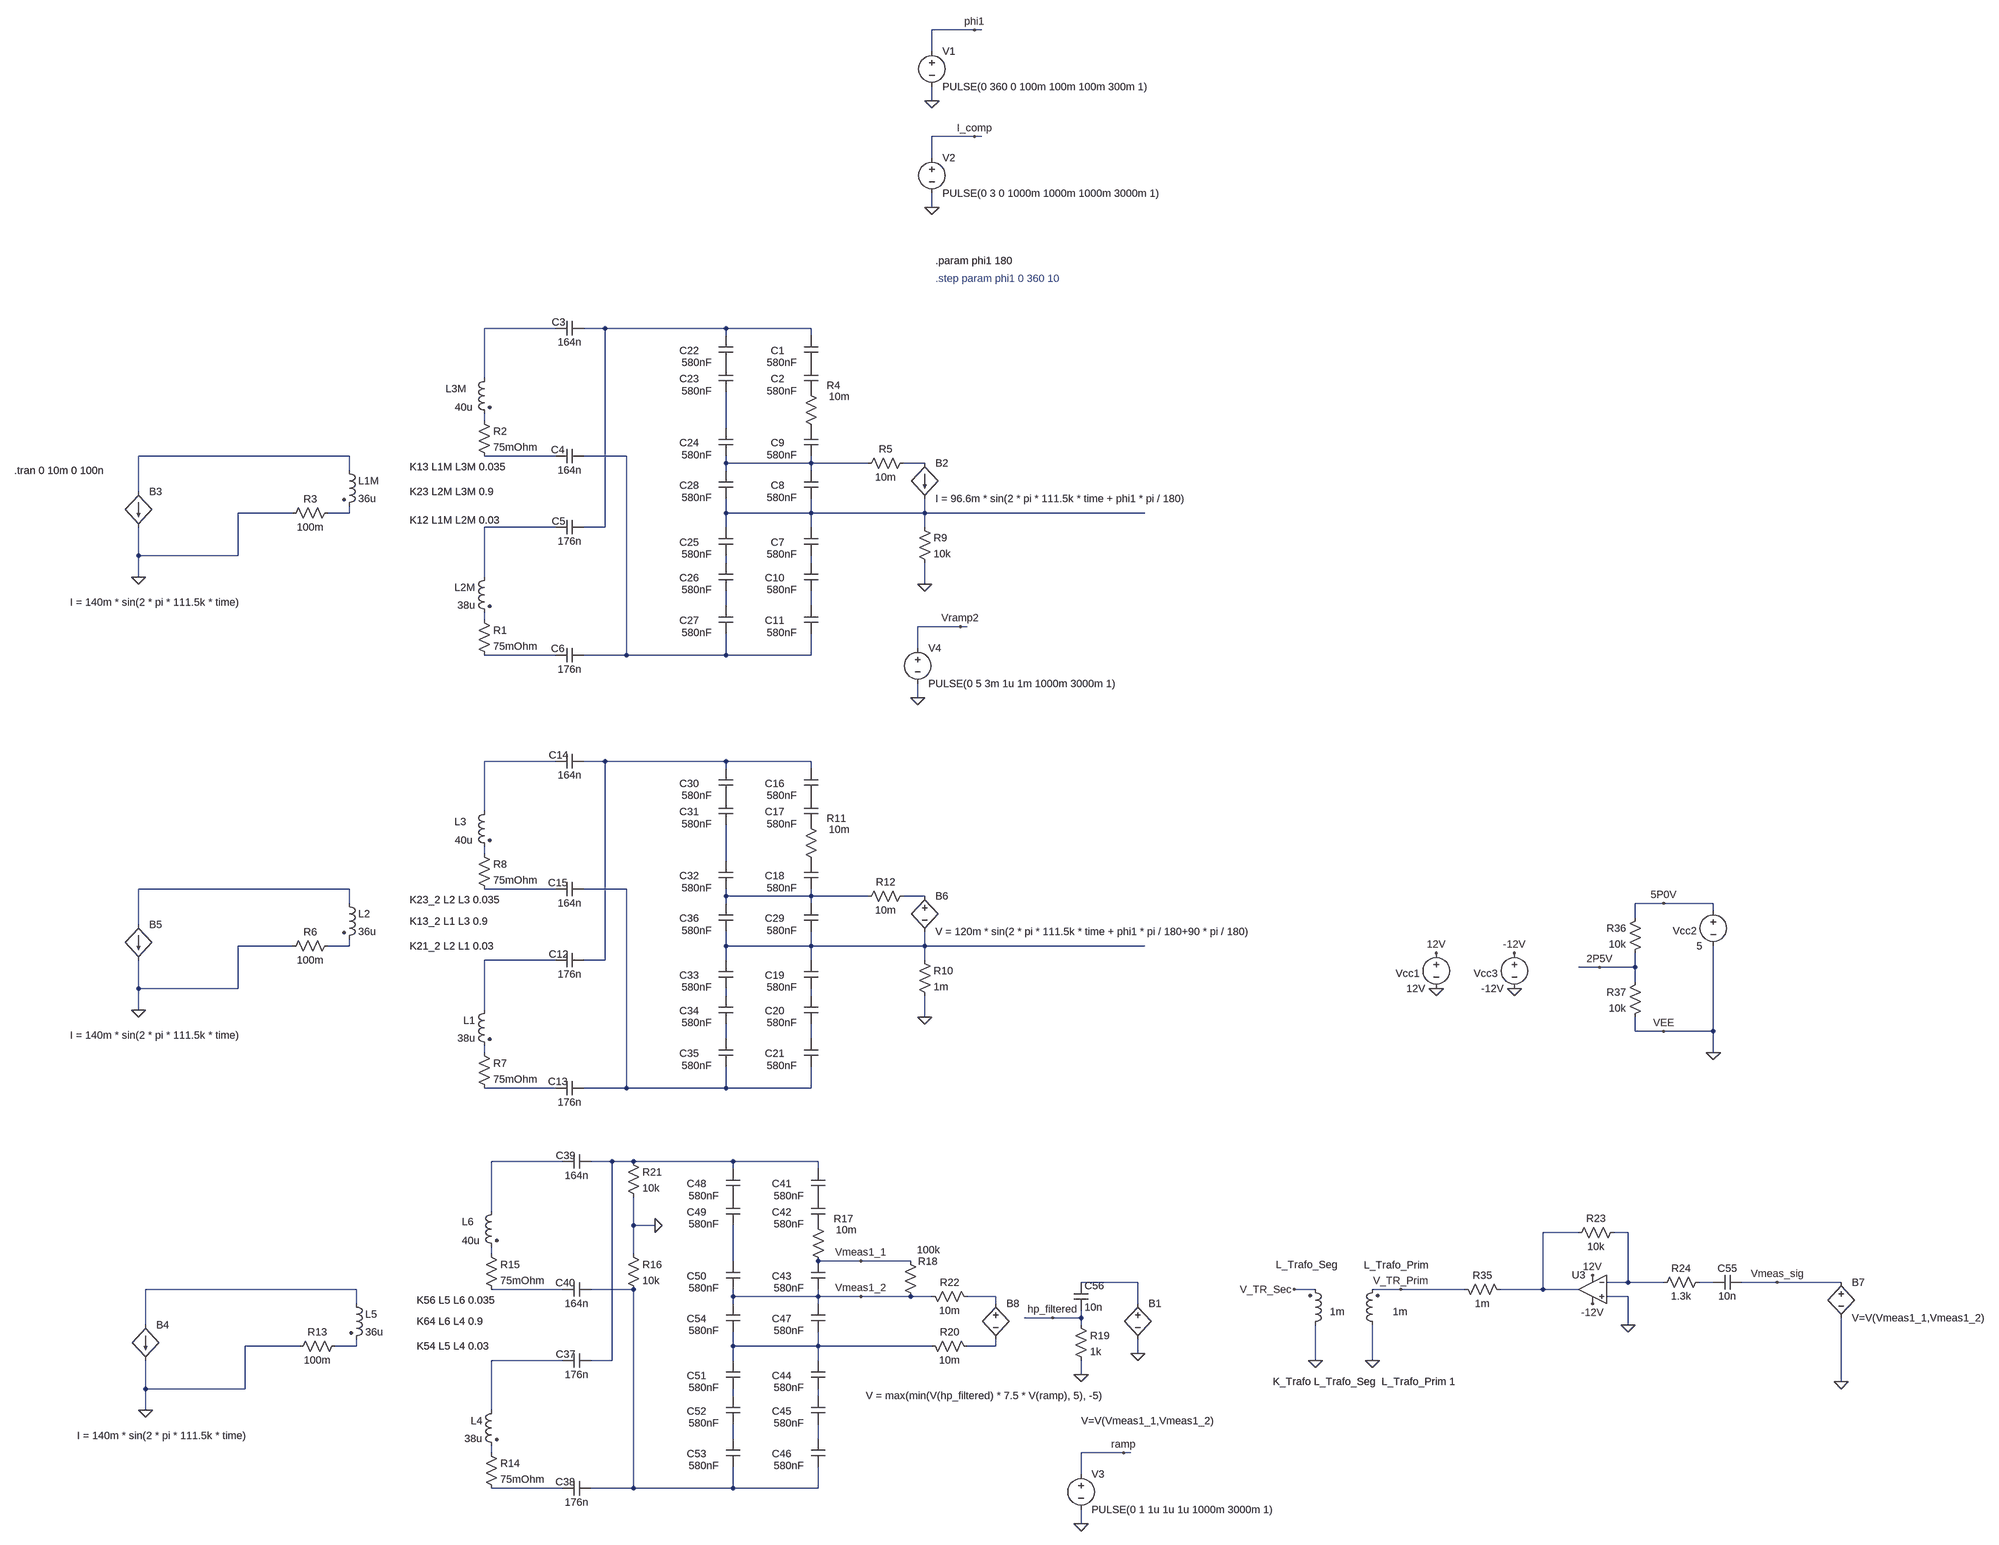
[diagram p0: schematic IMN_DIPS_CANCELATION_2.asc]
IMN_DIPS_CANCELATION_2.asc, the LTspice schematic file:
Version 4
SHEET 1 9932 3220
WIRE 3360 -1808 3264 -1808
WIRE 3376 -1808 3360 -1808
WIRE 3264 -1760 3264 -1808
WIRE 3264 -1648 3264 -1680
WIRE 3360 -1568 3264 -1568
WIRE 3376 -1568 3360 -1568
WIRE 3264 -1520 3264 -1568
WIRE 3264 -1408 3264 -1440
WIRE 2416 -1136 2256 -1136
WIRE 2528 -1136 2480 -1136
WIRE 2800 -1136 2528 -1136
WIRE 2992 -1136 2800 -1136
WIRE 2800 -1120 2800 -1136
WIRE 2992 -1120 2992 -1136
WIRE 2256 -1024 2256 -1136
WIRE 2256 -928 2256 -944
WIRE 2800 -912 2800 -992
WIRE 1952 -848 1472 -848
WIRE 2416 -848 2256 -848
WIRE 2576 -848 2480 -848
WIRE 2800 -832 2800 -848
WIRE 2992 -832 2992 -848
WIRE 2992 -832 2800 -832
WIRE 3120 -832 2992 -832
WIRE 3248 -832 3200 -832
WIRE 1952 -816 1952 -848
WIRE 2800 -816 2800 -832
WIRE 2992 -816 2992 -832
WIRE 1472 -768 1472 -848
WIRE 1824 -720 1696 -720
WIRE 1952 -720 1952 -736
WIRE 1952 -720 1904 -720
WIRE 2800 -720 2800 -752
WIRE 2992 -720 2992 -752
WIRE 2992 -720 2800 -720
WIRE 3248 -720 3248 -752
WIRE 3248 -720 2992 -720
WIRE 3744 -720 3248 -720
WIRE 2416 -688 2256 -688
WIRE 2528 -688 2528 -1136
WIRE 2528 -688 2480 -688
WIRE 2800 -688 2800 -720
WIRE 2992 -688 2992 -720
WIRE 3248 -688 3248 -720
WIRE 1472 -624 1472 -688
WIRE 1696 -624 1696 -720
WIRE 1696 -624 1472 -624
WIRE 2800 -608 2800 -624
WIRE 2992 -608 2992 -624
WIRE 1472 -576 1472 -624
WIRE 2256 -576 2256 -688
WIRE 3248 -560 3248 -608
WIRE 2800 -512 2800 -544
WIRE 2992 -512 2992 -544
WIRE 2256 -480 2256 -496
WIRE 3328 -464 3232 -464
WIRE 3344 -464 3328 -464
WIRE 3232 -416 3232 -464
WIRE 2416 -400 2256 -400
WIRE 2576 -400 2576 -848
WIRE 2576 -400 2480 -400
WIRE 2800 -400 2800 -448
WIRE 2800 -400 2576 -400
WIRE 2992 -400 2992 -448
WIRE 2992 -400 2800 -400
WIRE 3232 -304 3232 -336
WIRE 2416 -16 2256 -16
WIRE 2528 -16 2480 -16
WIRE 2800 -16 2528 -16
WIRE 2992 -16 2800 -16
WIRE 2800 0 2800 -16
WIRE 2992 0 2992 -16
WIRE 2256 96 2256 -16
WIRE 2256 192 2256 176
WIRE 2800 208 2800 128
WIRE 1952 272 1472 272
WIRE 2416 272 2256 272
WIRE 2576 272 2480 272
WIRE 2800 288 2800 272
WIRE 2992 288 2992 272
WIRE 2992 288 2800 288
WIRE 3120 288 2992 288
WIRE 3248 288 3200 288
WIRE 1952 304 1952 272
WIRE 2800 304 2800 288
WIRE 2992 304 2992 288
WIRE 4912 304 4848 304
WIRE 5024 304 4912 304
WIRE 5024 320 5024 304
WIRE 4848 336 4848 304
WIRE 1472 352 1472 272
WIRE 1824 400 1696 400
WIRE 1952 400 1952 384
WIRE 1952 400 1904 400
WIRE 2800 400 2800 368
WIRE 2992 400 2992 368
WIRE 2992 400 2800 400
WIRE 3248 400 3248 368
WIRE 3248 400 2992 400
WIRE 3744 400 3248 400
WIRE 2416 432 2256 432
WIRE 2528 432 2528 -16
WIRE 2528 432 2480 432
WIRE 2800 432 2800 400
WIRE 2992 432 2992 400
WIRE 3248 432 3248 400
WIRE 4768 448 4720 448
WIRE 4848 448 4848 416
WIRE 4848 448 4768 448
WIRE 4848 480 4848 448
WIRE 1472 496 1472 432
WIRE 1696 496 1696 400
WIRE 1696 496 1472 496
WIRE 2800 512 2800 496
WIRE 2992 512 2992 496
WIRE 1472 544 1472 496
WIRE 2256 544 2256 432
WIRE 3248 560 3248 512
WIRE 4848 592 4848 560
WIRE 4912 592 4848 592
WIRE 5024 592 5024 400
WIRE 5024 592 4912 592
WIRE 2800 608 2800 576
WIRE 2992 608 2992 576
WIRE 2256 640 2256 624
WIRE 5024 640 5024 592
WIRE 2416 720 2256 720
WIRE 2576 720 2576 272
WIRE 2576 720 2480 720
WIRE 2800 720 2800 672
WIRE 2800 720 2576 720
WIRE 2992 720 2992 672
WIRE 2992 720 2800 720
WIRE 2432 912 2272 912
WIRE 2544 912 2496 912
WIRE 2592 912 2544 912
WIRE 2816 912 2592 912
WIRE 3008 912 2816 912
WIRE 2816 928 2816 912
WIRE 3008 928 3008 912
WIRE 2272 1024 2272 912
WIRE 2592 1056 2592 992
WIRE 2640 1056 2592 1056
WIRE 4720 1072 4640 1072
WIRE 4832 1072 4800 1072
WIRE 2272 1120 2272 1104
WIRE 2592 1120 2592 1056
WIRE 2816 1136 2816 1056
WIRE 3104 1136 3008 1136
WIRE 3216 1136 3104 1136
WIRE 3728 1184 3600 1184
WIRE 4832 1184 4832 1072
WIRE 4832 1184 4784 1184
WIRE 4912 1184 4832 1184
WIRE 5024 1184 4992 1184
WIRE 5168 1184 5088 1184
WIRE 5312 1184 5168 1184
WIRE 1968 1200 1488 1200
WIRE 2432 1200 2272 1200
WIRE 2592 1200 2496 1200
WIRE 4128 1200 4080 1200
WIRE 4320 1200 4256 1200
WIRE 4464 1200 4320 1200
WIRE 4640 1200 4640 1072
WIRE 4640 1200 4544 1200
WIRE 4720 1200 4640 1200
WIRE 2816 1216 2816 1200
WIRE 3008 1216 3008 1200
WIRE 3008 1216 2816 1216
WIRE 3104 1216 3008 1216
WIRE 3216 1216 3104 1216
WIRE 3264 1216 3216 1216
WIRE 3408 1216 3344 1216
WIRE 4832 1216 4784 1216
WIRE 1968 1232 1968 1200
WIRE 2816 1232 2816 1216
WIRE 3008 1232 3008 1216
WIRE 3408 1232 3408 1216
WIRE 3728 1232 3728 1184
WIRE 3536 1264 3472 1264
WIRE 3600 1264 3600 1248
WIRE 3600 1264 3536 1264
WIRE 1488 1280 1488 1200
WIRE 3600 1280 3600 1264
WIRE 4832 1280 4832 1216
WIRE 1840 1328 1712 1328
WIRE 1968 1328 1968 1312
WIRE 1968 1328 1920 1328
WIRE 2816 1328 2816 1296
WIRE 3008 1328 3008 1296
WIRE 3008 1328 2816 1328
WIRE 3264 1328 3008 1328
WIRE 3408 1328 3408 1312
WIRE 3408 1328 3344 1328
WIRE 3728 1344 3728 1312
WIRE 2432 1360 2272 1360
WIRE 2544 1360 2544 912
WIRE 2544 1360 2496 1360
WIRE 2816 1360 2816 1328
WIRE 3008 1360 3008 1328
WIRE 4128 1360 4128 1280
WIRE 4256 1360 4256 1280
WIRE 3600 1392 3600 1360
WIRE 5312 1408 5312 1264
WIRE 1488 1424 1488 1360
WIRE 1712 1424 1712 1328
WIRE 1712 1424 1488 1424
WIRE 2816 1440 2816 1424
WIRE 3008 1440 3008 1424
WIRE 1488 1472 1488 1424
WIRE 2272 1472 2272 1360
WIRE 2816 1536 2816 1504
WIRE 3008 1536 3008 1504
WIRE 2272 1568 2272 1552
WIRE 3696 1568 3600 1568
WIRE 3712 1568 3696 1568
WIRE 3600 1616 3600 1568
WIRE 2432 1648 2272 1648
WIRE 2592 1648 2592 1200
WIRE 2592 1648 2496 1648
WIRE 2816 1648 2816 1600
WIRE 2816 1648 2592 1648
WIRE 3008 1648 3008 1600
WIRE 3008 1648 2816 1648
WIRE 3600 1728 3600 1696
FLAG 1472 -576 0
FLAG 3248 -560 0
FLAG 3264 -1648 0
FLAG 3360 -1808 phi1
FLAG 3264 -1408 0
FLAG 3360 -1568 I_comp
FLAG 3600 1728 0
FLAG 3696 1568 ramp
FLAG 3232 -304 0
FLAG 3328 -464 Vramp2
FLAG 1472 544 0
FLAG 3248 560 0
FLAG 1488 1472 0
FLAG 3104 1136 Vmeas1_1
FLAG 4912 304 5P0V
FLAG 4912 592 VEE
FLAG 4768 448 2P5V
FLAG 5024 640 0
FLAG 4128 1360 0
FLAG 4832 1280 0
FLAG 4256 1360 0
FLAG 4400 496 0
FLAG 4576 496 0
FLAG 4400 416 12V
FLAG 4576 416 -12V
FLAG 4752 1168 12V
FLAG 4752 1232 -12V
FLAG 4320 1200 V_TR_Prim
FLAG 4080 1200 V_TR_Sec
FLAG 5312 1408 0
FLAG 5168 1184 Vmeas_sig
FLAG 3104 1216 Vmeas1_2
FLAG 3728 1344 0
FLAG 3600 1392 0
FLAG 3536 1264 hp_filtered
FLAG 2640 1056 0
SYMBOL ind2 2272 -592 M0
SYMATTR Value 38u
SYMATTR InstName L2M
SYMATTR Type ind
SYMATTR SpiceLine Rpar=1MEG
SYMBOL ind2 1936 -832 R0
SYMATTR InstName L1M
SYMATTR Value 36u
SYMATTR Type ind
SYMATTR SpiceLine Rpar=1MEG
SYMBOL cap 2416 -672 R270
WINDOW 0 14 7 VTop 2
WINDOW 3 0 32 VBottom 2
SYMATTR InstName C5
SYMATTR Value 176n
SYMATTR SpiceLine Rser=3m
SYMBOL res 1920 -736 R90
WINDOW 0 0 56 VBottom 2
WINDOW 3 32 56 VTop 2
SYMATTR InstName R3
SYMATTR Value 100m
SYMBOL cap 2416 -384 R270
WINDOW 0 15 6 VTop 2
WINDOW 3 0 32 VBottom 2
SYMATTR InstName C6
SYMATTR Value 176n
SYMATTR SpiceLine Rser=3m
SYMBOL ind2 2272 -1040 M0
WINDOW 3 42 82 Left 2
WINDOW 0 56 40 Left 2
SYMATTR Value 40u
SYMATTR InstName L3M
SYMATTR Type ind
SYMATTR SpiceLine Rpar=1MEG
SYMBOL cap 2416 -1120 R270
WINDOW 0 14 7 VTop 2
WINDOW 3 0 32 VBottom 2
SYMATTR InstName C3
SYMATTR Value 164n
SYMATTR SpiceLine Rser=3m
SYMBOL cap 2416 -832 R270
WINDOW 0 15 6 VTop 2
WINDOW 3 0 32 VBottom 2
SYMATTR InstName C4
SYMATTR Value 164n
SYMATTR SpiceLine Rser=3m
SYMBOL res 2240 -496 R0
SYMATTR InstName R1
SYMATTR Value 75mOhm
SYMBOL res 2240 -944 R0
SYMATTR InstName R2
SYMATTR Value 75mOhm
SYMBOL cap 3008 -1056 R180
WINDOW 0 76 30 Left 2
WINDOW 3 47 3 Left 2
SYMATTR InstName C1
SYMATTR Value 580nF
SYMATTR SpiceLine Rser=3m
SYMBOL cap 3008 -992 R180
WINDOW 0 76 30 Left 2
WINDOW 3 47 3 Left 2
SYMATTR InstName C2
SYMATTR Value 580nF
SYMATTR SpiceLine Rser=3m
SYMBOL cap 3008 -848 R180
WINDOW 0 76 30 Left 2
WINDOW 3 47 3 Left 2
SYMATTR InstName C9
SYMATTR Value 580nF
SYMATTR SpiceLine Rser=3m
SYMBOL cap 3008 -624 R180
WINDOW 0 76 30 Left 2
WINDOW 3 47 3 Left 2
SYMATTR InstName C7
SYMATTR Value 580nF
SYMATTR SpiceLine Rser=3m
SYMBOL cap 3008 -544 R180
WINDOW 0 76 30 Left 2
WINDOW 3 47 3 Left 2
SYMATTR InstName C10
SYMATTR Value 580nF
SYMATTR SpiceLine Rser=3m
SYMBOL cap 3008 -448 R180
WINDOW 0 76 30 Left 2
WINDOW 3 47 3 Left 2
SYMATTR InstName C11
SYMATTR Value 580nF
SYMATTR SpiceLine Rser=3m
SYMBOL cap 3008 -752 R180
WINDOW 0 76 30 Left 2
WINDOW 3 47 3 Left 2
SYMATTR InstName C8
SYMATTR Value 580nF
SYMATTR SpiceLine Rser=3m
SYMBOL bi 3248 -832 R0
SYMATTR InstName B2
SYMATTR Value I = 96.6m * sin(2 * pi * 111.5k * time + phi1 * pi / 180)
SYMBOL res 3232 -704 R0
SYMATTR InstName R9
SYMATTR Value 10k
SYMBOL res 2976 -1008 R0
WINDOW 0 51 1 Left 2
WINDOW 3 56 26 Left 2
SYMATTR InstName R4
SYMATTR Value 10m
SYMBOL voltage 3264 -1776 R0
WINDOW 123 0 0 Left 0
WINDOW 39 0 0 Left 0
SYMATTR InstName V1
SYMATTR Value PULSE(0 360 0 100m 100m 100m 300m 1)
SYMBOL voltage 3264 -1536 R0
WINDOW 123 0 0 Left 0
WINDOW 39 0 0 Left 0
SYMATTR InstName V2
SYMATTR Value PULSE(0 3 0 1000m 1000m 1000m 3000m 1)
SYMBOL res 3216 -848 R90
WINDOW 0 0 56 VBottom 2
WINDOW 3 32 56 VTop 2
SYMATTR InstName R5
SYMATTR Value 10m
SYMBOL cap 2816 -1056 R180
WINDOW 0 76 30 Left 2
WINDOW 3 47 3 Left 2
SYMATTR InstName C22
SYMATTR Value 580nF
SYMATTR SpiceLine Rser=3m
SYMBOL cap 2816 -992 R180
WINDOW 0 76 30 Left 2
WINDOW 3 47 3 Left 2
SYMATTR InstName C23
SYMATTR Value 580nF
SYMATTR SpiceLine Rser=3m
SYMBOL cap 2816 -848 R180
WINDOW 0 76 30 Left 2
WINDOW 3 47 3 Left 2
SYMATTR InstName C24
SYMATTR Value 580nF
SYMATTR SpiceLine Rser=3m
SYMBOL cap 2816 -624 R180
WINDOW 0 76 30 Left 2
WINDOW 3 47 3 Left 2
SYMATTR InstName C25
SYMATTR Value 580nF
SYMATTR SpiceLine Rser=3m
SYMBOL cap 2816 -544 R180
WINDOW 0 76 30 Left 2
WINDOW 3 47 3 Left 2
SYMATTR InstName C26
SYMATTR Value 580nF
SYMATTR SpiceLine Rser=3m
SYMBOL cap 2816 -448 R180
WINDOW 0 76 30 Left 2
WINDOW 3 47 3 Left 2
SYMATTR InstName C27
SYMATTR Value 580nF
SYMATTR SpiceLine Rser=3m
SYMBOL cap 2816 -752 R180
WINDOW 0 76 30 Left 2
WINDOW 3 47 3 Left 2
SYMATTR InstName C28
SYMATTR Value 580nF
SYMATTR SpiceLine Rser=3m
SYMBOL bi 1472 -768 R0
WINDOW 3 -154 249 Left 2
SYMATTR Value I = 140m * sin(2 * pi * 111.5k * time)
SYMATTR InstName B3
SYMBOL voltage 3600 1600 R0
WINDOW 123 0 0 Left 0
WINDOW 39 0 0 Left 0
SYMATTR InstName V3
SYMATTR Value PULSE(0 1 1u 1u 1u 1000m 3000m 1)
SYMBOL voltage 3232 -432 R0
WINDOW 123 0 0 Left 0
WINDOW 39 0 0 Left 0
SYMATTR InstName V4
SYMATTR Value PULSE(0 5 3m 1u 1m 1000m 3000m 1)
SYMBOL ind2 2272 528 M0
SYMATTR Value 38u
SYMATTR InstName L1
SYMATTR Type ind
SYMATTR SpiceLine Rpar=1MEG
SYMBOL ind2 1936 288 R0
SYMATTR InstName L2
SYMATTR Value 36u
SYMATTR Type ind
SYMATTR SpiceLine Rpar=1MEG
SYMBOL cap 2416 448 R270
WINDOW 0 14 7 VTop 2
WINDOW 3 0 32 VBottom 2
SYMATTR InstName C12
SYMATTR Value 176n
SYMATTR SpiceLine Rser=3m
SYMBOL res 1920 384 R90
WINDOW 0 0 56 VBottom 2
WINDOW 3 32 56 VTop 2
SYMATTR InstName R6
SYMATTR Value 100m
SYMBOL cap 2416 736 R270
WINDOW 0 15 6 VTop 2
WINDOW 3 0 32 VBottom 2
SYMATTR InstName C13
SYMATTR Value 176n
SYMATTR SpiceLine Rser=3m
SYMBOL ind2 2272 80 M0
WINDOW 3 42 82 Left 2
WINDOW 0 56 40 Left 2
SYMATTR Value 40u
SYMATTR InstName L3
SYMATTR Type ind
SYMATTR SpiceLine Rpar=1MEG
SYMBOL cap 2416 0 R270
WINDOW 0 14 7 VTop 2
WINDOW 3 0 32 VBottom 2
SYMATTR InstName C14
SYMATTR Value 164n
SYMATTR SpiceLine Rser=3m
SYMBOL cap 2416 288 R270
WINDOW 0 15 6 VTop 2
WINDOW 3 0 32 VBottom 2
SYMATTR InstName C15
SYMATTR Value 164n
SYMATTR SpiceLine Rser=3m
SYMBOL res 2240 624 R0
SYMATTR InstName R7
SYMATTR Value 75mOhm
SYMBOL res 2240 176 R0
SYMATTR InstName R8
SYMATTR Value 75mOhm
SYMBOL cap 3008 64 R180
WINDOW 0 76 30 Left 2
WINDOW 3 47 3 Left 2
SYMATTR InstName C16
SYMATTR Value 580nF
SYMATTR SpiceLine Rser=3m
SYMBOL cap 3008 128 R180
WINDOW 0 76 30 Left 2
WINDOW 3 47 3 Left 2
SYMATTR InstName C17
SYMATTR Value 580nF
SYMATTR SpiceLine Rser=3m
SYMBOL cap 3008 272 R180
WINDOW 0 76 30 Left 2
WINDOW 3 47 3 Left 2
SYMATTR InstName C18
SYMATTR Value 580nF
SYMATTR SpiceLine Rser=3m
SYMBOL cap 3008 496 R180
WINDOW 0 76 30 Left 2
WINDOW 3 47 3 Left 2
SYMATTR InstName C19
SYMATTR Value 580nF
SYMATTR SpiceLine Rser=3m
SYMBOL cap 3008 576 R180
WINDOW 0 76 30 Left 2
WINDOW 3 47 3 Left 2
SYMATTR InstName C20
SYMATTR Value 580nF
SYMATTR SpiceLine Rser=3m
SYMBOL cap 3008 672 R180
WINDOW 0 76 30 Left 2
WINDOW 3 47 3 Left 2
SYMATTR InstName C21
SYMATTR Value 580nF
SYMATTR SpiceLine Rser=3m
SYMBOL cap 3008 368 R180
WINDOW 0 76 30 Left 2
WINDOW 3 47 3 Left 2
SYMATTR InstName C29
SYMATTR Value 580nF
SYMATTR SpiceLine Rser=3m
SYMBOL res 3232 416 R0
SYMATTR InstName R10
SYMATTR Value 1m
SYMBOL res 2976 112 R0
WINDOW 0 51 1 Left 2
WINDOW 3 56 26 Left 2
SYMATTR InstName R11
SYMATTR Value 10m
SYMBOL res 3216 272 R90
WINDOW 0 0 56 VBottom 2
WINDOW 3 32 56 VTop 2
SYMATTR InstName R12
SYMATTR Value 10m
SYMBOL cap 2816 64 R180
WINDOW 0 76 30 Left 2
WINDOW 3 47 3 Left 2
SYMATTR InstName C30
SYMATTR Value 580nF
SYMATTR SpiceLine Rser=3m
SYMBOL cap 2816 128 R180
WINDOW 0 76 30 Left 2
WINDOW 3 47 3 Left 2
SYMATTR InstName C31
SYMATTR Value 580nF
SYMATTR SpiceLine Rser=3m
SYMBOL cap 2816 272 R180
WINDOW 0 76 30 Left 2
WINDOW 3 47 3 Left 2
SYMATTR InstName C32
SYMATTR Value 580nF
SYMATTR SpiceLine Rser=3m
SYMBOL cap 2816 496 R180
WINDOW 0 76 30 Left 2
WINDOW 3 47 3 Left 2
SYMATTR InstName C33
SYMATTR Value 580nF
SYMATTR SpiceLine Rser=3m
SYMBOL cap 2816 576 R180
WINDOW 0 76 30 Left 2
WINDOW 3 47 3 Left 2
SYMATTR InstName C34
SYMATTR Value 580nF
SYMATTR SpiceLine Rser=3m
SYMBOL cap 2816 672 R180
WINDOW 0 76 30 Left 2
WINDOW 3 47 3 Left 2
SYMATTR InstName C35
SYMATTR Value 580nF
SYMATTR SpiceLine Rser=3m
SYMBOL cap 2816 368 R180
WINDOW 0 76 30 Left 2
WINDOW 3 47 3 Left 2
SYMATTR InstName C36
SYMATTR Value 580nF
SYMATTR SpiceLine Rser=3m
SYMBOL bi 1472 352 R0
WINDOW 3 -154 249 Left 2
SYMATTR Value I = 140m * sin(2 * pi * 111.5k * time)
SYMATTR InstName B5
SYMBOL bv 3248 272 R0
SYMATTR InstName B6
SYMATTR Value V = 120m * sin(2 * pi * 111.5k * time + phi1 * pi / 180+90 * pi / 180)
SYMBOL ind2 2288 1456 M0
SYMATTR Value 38u
SYMATTR InstName L4
SYMATTR Type ind
SYMATTR SpiceLine Rpar=1MEG
SYMBOL ind2 1952 1216 R0
SYMATTR InstName L5
SYMATTR Value 36u
SYMATTR Type ind
SYMATTR SpiceLine Rpar=1MEG
SYMBOL cap 2432 1376 R270
WINDOW 0 14 7 VTop 2
WINDOW 3 0 32 VBottom 2
SYMATTR InstName C37
SYMATTR Value 176n
SYMATTR SpiceLine Rser=3m
SYMBOL res 1936 1312 R90
WINDOW 0 0 56 VBottom 2
WINDOW 3 32 56 VTop 2
SYMATTR InstName R13
SYMATTR Value 100m
SYMBOL cap 2432 1664 R270
WINDOW 0 15 6 VTop 2
WINDOW 3 0 32 VBottom 2
SYMATTR InstName C38
SYMATTR Value 176n
SYMATTR SpiceLine Rser=3m
SYMBOL ind2 2288 1008 M0
WINDOW 3 42 82 Left 2
WINDOW 0 56 40 Left 2
SYMATTR Value 40u
SYMATTR InstName L6
SYMATTR Type ind
SYMATTR SpiceLine Rpar=1MEG
SYMBOL cap 2432 928 R270
WINDOW 0 14 7 VTop 2
WINDOW 3 0 32 VBottom 2
SYMATTR InstName C39
SYMATTR Value 164n
SYMATTR SpiceLine Rser=3m
SYMBOL cap 2432 1216 R270
WINDOW 0 15 6 VTop 2
WINDOW 3 0 32 VBottom 2
SYMATTR InstName C40
SYMATTR Value 164n
SYMATTR SpiceLine Rser=3m
SYMBOL res 2256 1552 R0
SYMATTR InstName R14
SYMATTR Value 75mOhm
SYMBOL res 2256 1104 R0
SYMATTR InstName R15
SYMATTR Value 75mOhm
SYMBOL cap 3024 992 R180
WINDOW 0 76 30 Left 2
WINDOW 3 47 3 Left 2
SYMATTR InstName C41
SYMATTR Value 580nF
SYMATTR SpiceLine Rser=3m
SYMBOL cap 3024 1056 R180
WINDOW 0 76 30 Left 2
WINDOW 3 47 3 Left 2
SYMATTR InstName C42
SYMATTR Value 580nF
SYMATTR SpiceLine Rser=3m
SYMBOL cap 3024 1200 R180
WINDOW 0 76 30 Left 2
WINDOW 3 47 3 Left 2
SYMATTR InstName C43
SYMATTR Value 580nF
SYMATTR SpiceLine Rser=3m
SYMBOL cap 3024 1424 R180
WINDOW 0 76 30 Left 2
WINDOW 3 47 3 Left 2
SYMATTR InstName C44
SYMATTR Value 580nF
SYMATTR SpiceLine Rser=3m
SYMBOL cap 3024 1504 R180
WINDOW 0 76 30 Left 2
WINDOW 3 47 3 Left 2
SYMATTR InstName C45
SYMATTR Value 580nF
SYMATTR SpiceLine Rser=3m
SYMBOL cap 3024 1600 R180
WINDOW 0 76 30 Left 2
WINDOW 3 47 3 Left 2
SYMATTR InstName C46
SYMATTR Value 580nF
SYMATTR SpiceLine Rser=3m
SYMBOL cap 3024 1296 R180
WINDOW 0 76 30 Left 2
WINDOW 3 47 3 Left 2
SYMATTR InstName C47
SYMATTR Value 580nF
SYMATTR SpiceLine Rser=3m
SYMBOL res 2992 1040 R0
WINDOW 0 51 1 Left 2
WINDOW 3 56 26 Left 2
SYMATTR InstName R17
SYMATTR Value 10m
SYMBOL cap 2832 992 R180
WINDOW 0 76 30 Left 2
WINDOW 3 47 3 Left 2
SYMATTR InstName C48
SYMATTR Value 580nF
SYMATTR SpiceLine Rser=3m
SYMBOL cap 2832 1056 R180
WINDOW 0 76 30 Left 2
WINDOW 3 47 3 Left 2
SYMATTR InstName C49
SYMATTR Value 580nF
SYMATTR SpiceLine Rser=3m
SYMBOL cap 2832 1200 R180
WINDOW 0 76 30 Left 2
WINDOW 3 47 3 Left 2
SYMATTR InstName C50
SYMATTR Value 580nF
SYMATTR SpiceLine Rser=3m
SYMBOL cap 2832 1424 R180
WINDOW 0 76 30 Left 2
WINDOW 3 47 3 Left 2
SYMATTR InstName C51
SYMATTR Value 580nF
SYMATTR SpiceLine Rser=3m
SYMBOL cap 2832 1504 R180
WINDOW 0 76 30 Left 2
WINDOW 3 47 3 Left 2
SYMATTR InstName C52
SYMATTR Value 580nF
SYMATTR SpiceLine Rser=3m
SYMBOL cap 2832 1600 R180
WINDOW 0 76 30 Left 2
WINDOW 3 47 3 Left 2
SYMATTR InstName C53
SYMATTR Value 580nF
SYMATTR SpiceLine Rser=3m
SYMBOL cap 2832 1296 R180
WINDOW 0 76 30 Left 2
WINDOW 3 47 3 Left 2
SYMATTR InstName C54
SYMATTR Value 580nF
SYMATTR SpiceLine Rser=3m
SYMBOL bi 1488 1280 R0
WINDOW 3 -154 249 Left 2
SYMATTR Value I = 140m * sin(2 * pi * 111.5k * time)
SYMATTR InstName B4
SYMBOL voltage 4400 400 M0
WINDOW 123 0 0 Left 2
WINDOW 0 38 62 Left 2
WINDOW 39 0 0 Left 0
SYMATTR InstName Vcc1
SYMATTR Value 12V
SYMBOL res 3360 1232 M270
WINDOW 0 32 56 VTop 2
WINDOW 3 0 56 VBottom 2
SYMATTR InstName R22
SYMATTR Value 10m
SYMBOL res 4448 1184 M90
WINDOW 0 0 56 VBottom 2
WINDOW 3 32 56 VTop 2
SYMATTR InstName R35
SYMATTR Value 1m
SYMBOL cap 5024 1168 M90
WINDOW 0 0 32 VBottom 2
WINDOW 3 32 32 VTop 2
SYMATTR InstName C55
SYMATTR Value 10n
SYMBOL voltage 5024 304 M0
WINDOW 123 0 0 Left 2
WINDOW 0 38 62 Left 2
SYMATTR InstName Vcc2
SYMATTR Value 5
SYMBOL res 4864 320 M0
SYMATTR InstName R36
SYMATTR Value 10k
SYMBOL res 4864 464 M0
SYMATTR InstName R37
SYMATTR Value 10k
SYMBOL OpAmps\\UniversalOpAmp 4752 1200 M0
SYMATTR InstName U3
SYMBOL res 4816 1056 R90
WINDOW 0 0 56 VBottom 2
WINDOW 3 32 56 VTop 2
SYMATTR InstName R23
SYMATTR Value 10k
SYMBOL res 5008 1168 R90
WINDOW 0 0 56 VBottom 2
WINDOW 3 32 56 VTop 2
SYMATTR InstName R24
SYMATTR Value 1.3k
SYMBOL voltage 4576 400 M0
WINDOW 123 0 0 Left 2
WINDOW 0 38 62 Left 2
WINDOW 39 0 0 Left 0
SYMATTR InstName Vcc3
SYMATTR Value -12V
SYMBOL ind2 4112 1296 M180
WINDOW 0 -73 152 Left 2
WINDOW 3 48 46 Left 2
SYMATTR InstName L_Trafo_Seg
SYMATTR Value 1m
SYMATTR Type ind
SYMATTR SpiceLine Rpar=1MEG
SYMBOL ind2 4272 1296 R180
WINDOW 0 -112 151 Left 2
WINDOW 3 -64 46 Left 2
SYMATTR InstName L_Trafo_Prim
SYMATTR Value 1m
SYMATTR Type ind
SYMATTR SpiceLine Rpar=1MEG
SYMBOL bv 5312 1168 R0
SYMATTR InstName B7
SYMATTR Value V=V(Vmeas1_1,Vmeas1_2)
SYMBOL bv 3408 1216 R0
WINDOW 3 -293 223 Left 2
SYMATTR InstName B8
SYMATTR Value V = max(min(V(hp_filtered) * 7.5 * V(ramp), 5), -5)
SYMBOL res 3200 1120 R0
WINDOW 0 33 17 Left 2
WINDOW 3 30 -9 Left 2
SYMATTR InstName R18
SYMATTR Value 100k
SYMBOL bv 3728 1216 R0
WINDOW 3 -128 280 Left 2
SYMATTR InstName B1
SYMATTR Value V=V(Vmeas1_1,Vmeas1_2)
SYMBOL cap 3584 1184 R0
SYMATTR InstName C56
SYMATTR Value 10n
SYMBOL res 3584 1264 R0
SYMATTR InstName R19
SYMATTR Value 1k
SYMBOL res 3360 1344 M270
WINDOW 0 32 56 VTop 2
WINDOW 3 0 56 VBottom 2
SYMATTR InstName R20
SYMATTR Value 10m
SYMBOL res 2576 1104 R0
SYMATTR InstName R16
SYMATTR Value 10k
SYMBOL res 2576 896 R0
SYMATTR InstName R21
SYMATTR Value 10k
TEXT 2088 -704 Left 2 !K12 L1M L2M 0.03
TEXT 1192 -816 Left 2 !.tran 0 10m 0 100n
TEXT 2088 -824 Left 2 !K13 L1M L3M 0.035
TEXT 2088 -768 Left 2 !K23 L2M L3M 0.9
TEXT 3272 -1248 Left 2 ;.step param phi1 0 360 10
TEXT 3272 -1288 Left 2 !.param phi1 180
TEXT 2088 344 Left 2 !K13_2 L1 L3 0.9
TEXT 2088 296 Left 2 !K23_2 L2 L3 0.035
TEXT 2088 400 Left 2 !K21_2 L2 L1 0.03
TEXT 2104 1272 Left 2 !K64 L6 L4 0.9
TEXT 2104 1224 Left 2 !K56 L5 L6 0.035
TEXT 2104 1328 Left 2 !K54 L5 L4 0.03
TEXT 4032 1408 Left 2 !K_Trafo L_Trafo_Seg  L_Trafo_Prim 1

The netlist it stands for:
* IMN_DIPS_CANCELATION_2.asc
L2M N012 N017 38u Rpar=1MEG
L1M N005 N010 36u Rpar=1MEG
C5 N012 N002 176n Rser=3m
R3 N010 0 100m
C6 N018 N007 176n Rser=3m
L3M N001 N003 40u Rpar=1MEG
C3 N001 N002 164n Rser=3m
C4 N006 N007 164n Rser=3m
R1 N017 N018 75mOhm
R2 N003 N006 75mOhm
C1 P001 N002 580nF Rser=3m
C2 P002 P001 580nF Rser=3m
C9 N008 P003 580nF Rser=3m
C7 N014 N011 580nF Rser=3m
C10 N016 N014 580nF Rser=3m
C11 N007 N016 580nF Rser=3m
C8 N011 N008 580nF Rser=3m
B2 N009 N011 I = 96.6m * sin(2 * pi * 111.5k * time + phi1 * pi / 180)
R9 N011 0 10k
R4 P002 P003 10m
V1 phi1 0 PULSE(0 360 0 100m 100m 100m 300m 1)
V2 I_comp 0 PULSE(0 3 0 1000m 1000m 1000m 3000m 1)
R5 N009 N008 10m
C22 P004 N002 580nF Rser=3m
C23 N004 P004 580nF Rser=3m
C24 N008 N004 580nF Rser=3m
C25 N013 N011 580nF Rser=3m
C26 N015 N013 580nF Rser=3m
C27 N007 N015 580nF Rser=3m
C28 N011 N008 580nF Rser=3m
B3 N005 0 I = 140m * sin(2 * pi * 111.5k * time)
V3 ramp 0 PULSE(0 1 1u 1u 1u 1000m 3000m 1)
V4 Vramp2 0 PULSE(0 5 3m 1u 1m 1000m 3000m 1)
L1 N030 N035 38u Rpar=1MEG
L2 N023 N028 36u Rpar=1MEG
C12 N030 N020 176n Rser=3m
R6 N028 0 100m
C13 N036 N025 176n Rser=3m
L3 N019 N021 40u Rpar=1MEG
C14 N019 N020 164n Rser=3m
C15 N024 N025 164n Rser=3m
R7 N035 N036 75mOhm
R8 N021 N024 75mOhm
C16 P005 N020 580nF Rser=3m
C17 P006 P005 580nF Rser=3m
C18 N026 P007 580nF Rser=3m
C19 N032 N029 580nF Rser=3m
C20 N034 N032 580nF Rser=3m
C21 N025 N034 580nF Rser=3m
C29 N029 N026 580nF Rser=3m
R10 N029 0 1m
R11 P006 P007 10m
R12 N027 N026 10m
C30 P008 N020 580nF Rser=3m
C31 N022 P008 580nF Rser=3m
C32 N026 N022 580nF Rser=3m
C33 N031 N029 580nF Rser=3m
C34 N033 N031 580nF Rser=3m
C35 N025 N033 580nF Rser=3m
C36 N029 N026 580nF Rser=3m
B5 N023 0 I = 140m * sin(2 * pi * 111.5k * time)
B6 N027 N029 V = 120m * sin(2 * pi * 111.5k * time + phi1 * pi / 180+90 * pi / 180)
L4 N052 N057 38u Rpar=1MEG
L5 N045 N049 36u Rpar=1MEG
C37 N052 N038 176n Rser=3m
R13 N049 0 100m
C38 N058 N047 176n Rser=3m
L6 N037 N041 40u Rpar=1MEG
C39 N037 N038 164n Rser=3m
C40 N046 N047 164n Rser=3m
R14 N057 N058 75mOhm
R15 N041 N046 75mOhm
C41 P009 N038 580nF Rser=3m
C42 P010 P009 580nF Rser=3m
C43 Vmeas1_2 Vmeas1_1 580nF Rser=3m
C44 N054 N050 580nF Rser=3m
C45 N056 N054 580nF Rser=3m
C46 N047 N056 580nF Rser=3m
C47 N050 Vmeas1_2 580nF Rser=3m
R17 P010 Vmeas1_1 10m
C48 P011 N038 580nF Rser=3m
C49 N042 P011 580nF Rser=3m
C50 Vmeas1_2 N042 580nF Rser=3m
C51 N053 N050 580nF Rser=3m
C52 N055 N053 580nF Rser=3m
C53 N047 N055 580nF Rser=3m
C54 N050 Vmeas1_2 580nF Rser=3m
B4 N045 0 I = 140m * sin(2 * pi * 111.5k * time)
Vcc1 12V 0 12V
R22 N048 Vmeas1_2 10m
R35 V_TR_Prim N039 1m
C55 N044 Vmeas_sig 10n
Vcc2 5P0V 0 5
R36 5P0V 2P5V 10k
R37 2P5V 0 10k
XU3 0 N040 12V -12V N039 level1 Avol=1Meg GBW=10Meg Vos=0 En=0 Enk=0 In=0 Ink=0 Rin=500Meg  ; pins In+ In- V+ V- OUT
R23 N040 N039 10k
R24 N044 N040 1.3k
Vcc3 -12V 0 -12V
L_Trafo_Seg 0 V_TR_Sec 1m Rpar=1MEG
L_Trafo_Prim 0 V_TR_Prim 1m Rpar=1MEG
B7 Vmeas_sig 0 V=V(Vmeas1_1,Vmeas1_2)
B8 N048 N051 V = max(min(V(hp_filtered) * 7.5 * V(ramp), 5), -5)
R18 Vmeas1_1 Vmeas1_2 100k
B1 N043 0 V=V(Vmeas1_1,Vmeas1_2)
C56 N043 hp_filtered 10n
R19 hp_filtered 0 1k
R20 N051 N050 10m
R16 0 N047 10k
R21 N038 0 10k
K12 L1M L2M 0.03
.tran 0 10m 0 100n
K13 L1M L3M 0.035
K23 L2M L3M 0.9
* .step param phi1 0 360 10
.param phi1 180
K13_2 L1 L3 0.9
K23_2 L2 L3 0.035
K21_2 L2 L1 0.03
K64 L6 L4 0.9
K56 L5 L6 0.035
K54 L5 L4 0.03
K_Trafo L_Trafo_Seg  L_Trafo_Prim 1
.lib UniversalOpAmp1.lib
.backanno
.end